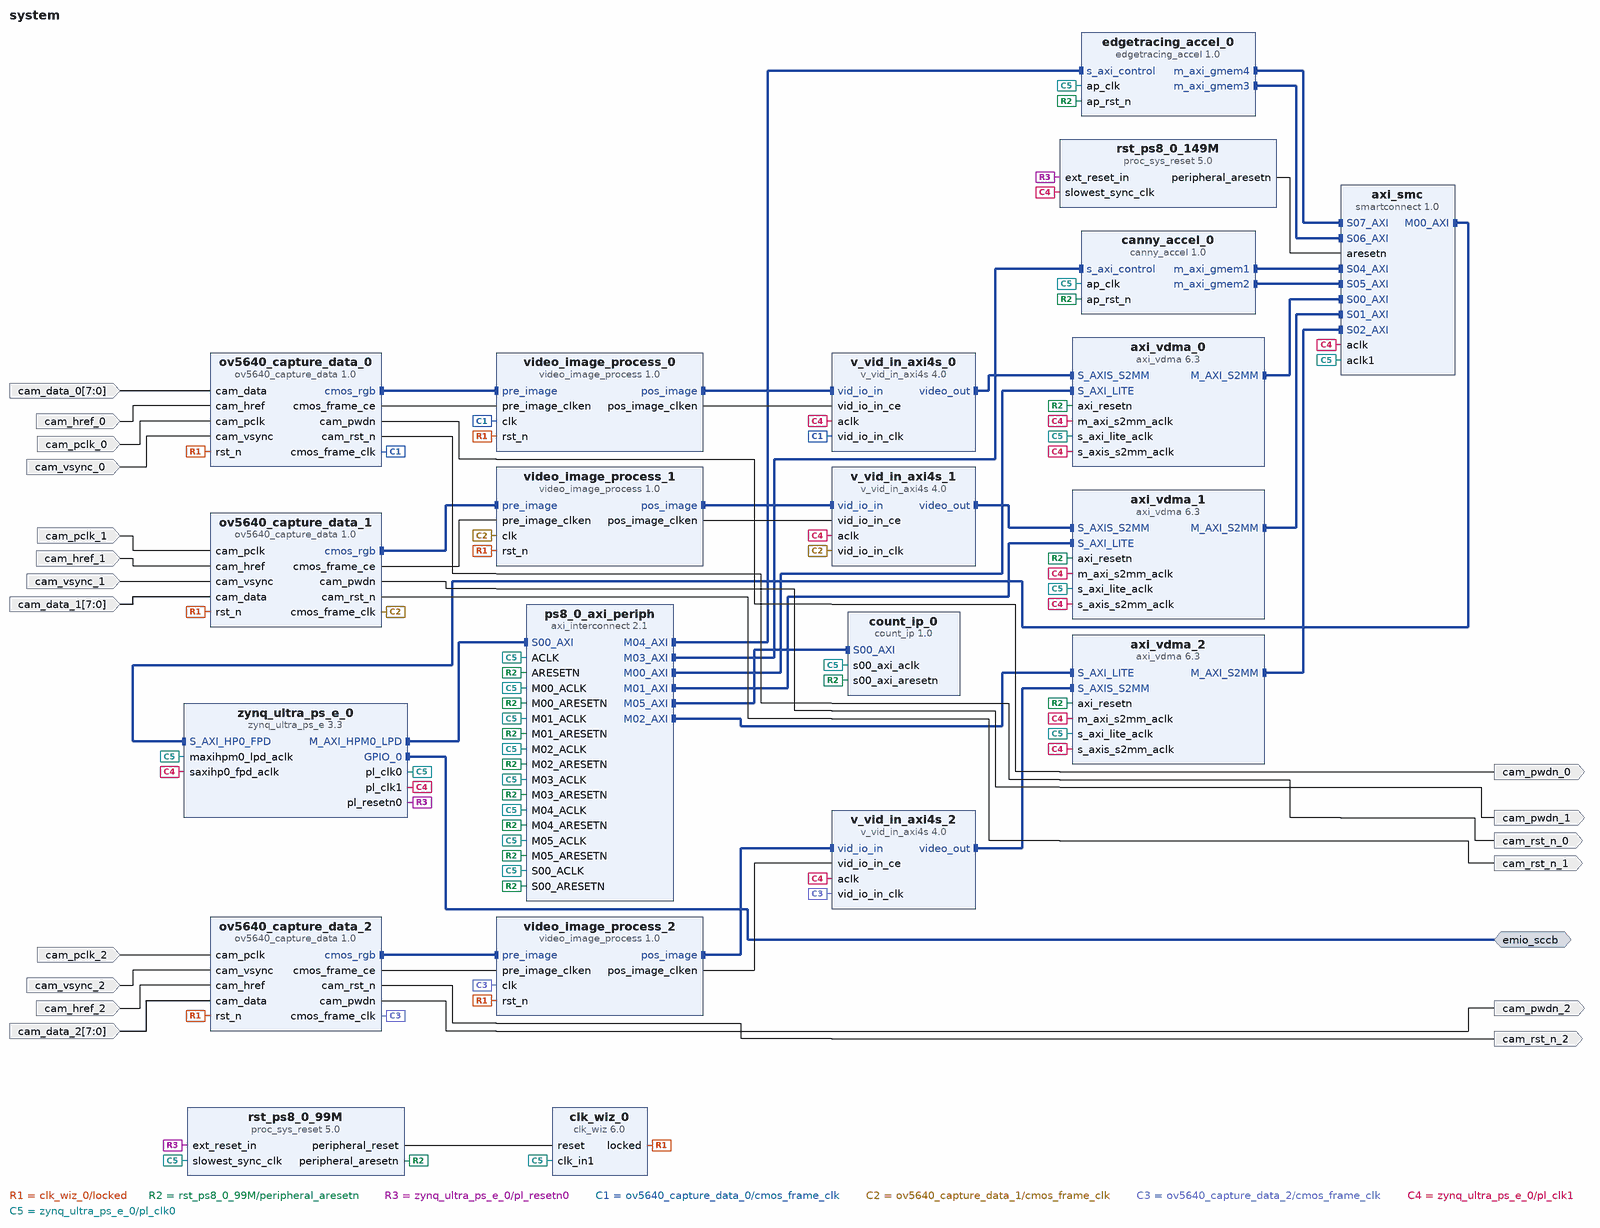
[diagram p0: block diagram of the top level]
# Vivado block design system, xczu2cg-sfvc784-2-i, Vivado 2020.2
create_bd_design system

create_bd_intf_port -mode Master -vlnv xilinx.com:interface:gpio_rtl:1.0 emio_sccb
create_bd_port -dir I -from 7 -to 0 cam_data_0
create_bd_port -dir I cam_href_0
create_bd_port -dir I cam_pclk_0
create_bd_port -dir O cam_pwdn_0
create_bd_port -dir O -type rst cam_rst_n_0
create_bd_port -dir I cam_vsync_0
create_bd_port -dir I cam_pclk_1
create_bd_port -dir I cam_href_1
create_bd_port -dir I cam_vsync_1
create_bd_port -dir I -from 7 -to 0 cam_data_1
create_bd_port -dir O cam_pwdn_1
create_bd_port -dir O -type rst cam_rst_n_1
create_bd_port -dir I cam_pclk_2
create_bd_port -dir I cam_vsync_2
create_bd_port -dir I cam_href_2
create_bd_port -dir I -from 7 -to 0 cam_data_2
create_bd_port -dir O -type rst cam_rst_n_2
create_bd_port -dir O cam_pwdn_2

create_bd_cell -type ip -vlnv xilinx.com:ip:axi_vdma:6.3 axi_vdma_0
set_property -dict [list \
  CONFIG.c_include_mm2s 0 \
  CONFIG.c_include_s2mm 1 \
  CONFIG.c_num_fstores 1 \
  CONFIG.c_s2mm_genlock_mode 0 \
  CONFIG.c_s2mm_linebuffer_depth 2048 \
  CONFIG.c_s2mm_max_burst_length 64 \
] [get_bd_cells axi_vdma_0]
create_bd_cell -type ip -vlnv xilinx.com:ip:clk_wiz:6.0 clk_wiz_0
set_property -dict [list \
  CONFIG.AXI_DRP false \
  CONFIG.CLKIN2_JITTER_PS 100.0 \
  CONFIG.CLKOUT1_DRIVES Buffer \
  CONFIG.CLKOUT1_JITTER 148.818 \
  CONFIG.CLKOUT1_PHASE_ERROR 251.185 \
  CONFIG.CLKOUT1_REQUESTED_OUT_FREQ 75 \
  CONFIG.CLKOUT2_DRIVES Buffer \
  CONFIG.CLKOUT2_JITTER 132.180 \
  CONFIG.CLKOUT2_PHASE_ERROR 251.185 \
  CONFIG.CLKOUT2_REQUESTED_OUT_FREQ 187.5 \
  CONFIG.CLKOUT2_USED true \
  CONFIG.CLKOUT3_DRIVES Buffer \
  CONFIG.CLKOUT3_JITTER 121.133 \
  CONFIG.CLKOUT3_PHASE_ERROR 251.185 \
  CONFIG.CLKOUT3_REQUESTED_OUT_FREQ 375 \
  CONFIG.CLKOUT3_USED true \
  CONFIG.CLKOUT4_DRIVES Buffer \
  CONFIG.CLKOUT5_DRIVES Buffer \
  CONFIG.CLKOUT6_DRIVES Buffer \
  CONFIG.CLKOUT7_DRIVES Buffer \
  CONFIG.MMCM_CLKFBOUT_MULT_F 75 \
  CONFIG.MMCM_CLKIN2_PERIOD 10.000 \
  CONFIG.MMCM_CLKOUT0_DIVIDE_F 20 \
  CONFIG.MMCM_CLKOUT1_DIVIDE 8 \
  CONFIG.MMCM_CLKOUT2_DIVIDE 4 \
  CONFIG.MMCM_DIVCLK_DIVIDE 5 \
  CONFIG.NUM_OUT_CLKS 3 \
  CONFIG.OVERRIDE_MMCM true \
  CONFIG.PHASE_DUTY_CONFIG false \
  CONFIG.SECONDARY_IN_FREQ 100.000 \
  CONFIG.SECONDARY_SOURCE Single_ended_clock_capable_pin \
  CONFIG.USE_DYN_RECONFIG false \
  CONFIG.USE_INCLK_SWITCHOVER false \
  CONFIG.USE_PHASE_ALIGNMENT false \
] [get_bd_cells clk_wiz_0]
create_bd_cell -type ip -vlnv xilinx.com:ip:proc_sys_reset:5.0 rst_ps8_0_99M
create_bd_cell -type ip -vlnv xilinx.com:ip:zynq_ultra_ps_e:3.3 zynq_ultra_ps_e_0
set_property -dict [list \
  CONFIG.CAN0_BOARD_INTERFACE custom \
  CONFIG.CAN1_BOARD_INTERFACE custom \
  CONFIG.CSU_BOARD_INTERFACE custom \
  CONFIG.DP_BOARD_INTERFACE custom \
  CONFIG.GEM0_BOARD_INTERFACE custom \
  CONFIG.GEM1_BOARD_INTERFACE custom \
  CONFIG.GEM2_BOARD_INTERFACE custom \
  CONFIG.GEM3_BOARD_INTERFACE custom \
  CONFIG.GPIO_BOARD_INTERFACE custom \
  CONFIG.IIC0_BOARD_INTERFACE custom \
  CONFIG.IIC1_BOARD_INTERFACE custom \
  CONFIG.NAND_BOARD_INTERFACE custom \
  CONFIG.PCIE_BOARD_INTERFACE custom \
  CONFIG.PJTAG_BOARD_INTERFACE custom \
  CONFIG.PMU_BOARD_INTERFACE custom \
  CONFIG.PSU_BANK_0_IO_STANDARD LVCMOS18 \
  CONFIG.PSU_BANK_1_IO_STANDARD LVCMOS33 \
  CONFIG.PSU_BANK_2_IO_STANDARD LVCMOS18 \
  CONFIG.PSU_BANK_3_IO_STANDARD LVCMOS33 \
  CONFIG.PSU_USB3__DUAL_CLOCK_ENABLE 0 \
  CONFIG.PSU__ACPU2__POWER__ON 0 \
  CONFIG.PSU__ACPU3__POWER__ON 0 \
  CONFIG.PSU__CAN1__PERIPHERAL__ENABLE 0 \
  CONFIG.PSU__CRF_APB__ACPU_CTRL__FREQMHZ 1333.333 \
  CONFIG.PSU__CRF_APB__ACPU_CTRL__SRCSEL APLL \
  CONFIG.PSU__CRF_APB__APLL_CTRL__SRCSEL PSS_REF_CLK \
  CONFIG.PSU__CRF_APB__DBG_FPD_CTRL__FREQMHZ 250 \
  CONFIG.PSU__CRF_APB__DBG_FPD_CTRL__SRCSEL IOPLL \
  CONFIG.PSU__CRF_APB__DBG_TRACE_CTRL__FREQMHZ 250 \
  CONFIG.PSU__CRF_APB__DBG_TRACE_CTRL__SRCSEL IOPLL \
  CONFIG.PSU__CRF_APB__DBG_TSTMP_CTRL__FREQMHZ 250 \
  CONFIG.PSU__CRF_APB__DBG_TSTMP_CTRL__SRCSEL IOPLL \
  CONFIG.PSU__CRF_APB__DDR_CTRL__FREQMHZ 1200 \
  CONFIG.PSU__CRF_APB__DDR_CTRL__SRCSEL DPLL \
  CONFIG.PSU__CRF_APB__DPDMA_REF_CTRL__FREQMHZ 600 \
  CONFIG.PSU__CRF_APB__DPDMA_REF_CTRL__SRCSEL DPLL \
  CONFIG.PSU__CRF_APB__DPLL_CTRL__SRCSEL PSS_REF_CLK \
  CONFIG.PSU__CRF_APB__DP_AUDIO_REF_CTRL__SRCSEL VPLL \
  CONFIG.PSU__CRF_APB__DP_STC_REF_CTRL__SRCSEL VPLL \
  CONFIG.PSU__CRF_APB__DP_VIDEO_REF_CTRL__SRCSEL DPLL \
  CONFIG.PSU__CRF_APB__GDMA_REF_CTRL__FREQMHZ 600 \
  CONFIG.PSU__CRF_APB__GDMA_REF_CTRL__SRCSEL DPLL \
  CONFIG.PSU__CRF_APB__GPU_REF_CTRL__FREQMHZ 600 \
  CONFIG.PSU__CRF_APB__GPU_REF_CTRL__SRCSEL DPLL \
  CONFIG.PSU__CRF_APB__TOPSW_LSBUS_CTRL__FREQMHZ 100 \
  CONFIG.PSU__CRF_APB__TOPSW_LSBUS_CTRL__SRCSEL IOPLL \
  CONFIG.PSU__CRF_APB__TOPSW_MAIN_CTRL__FREQMHZ 533.333 \
  CONFIG.PSU__CRF_APB__TOPSW_MAIN_CTRL__SRCSEL VPLL \
  CONFIG.PSU__CRF_APB__VPLL_CTRL__SRCSEL PSS_REF_CLK \
  CONFIG.PSU__CRL_APB__ADMA_REF_CTRL__FREQMHZ 533.333 \
  CONFIG.PSU__CRL_APB__ADMA_REF_CTRL__SRCSEL RPLL \
  CONFIG.PSU__CRL_APB__CAN1_REF_CTRL__FREQMHZ 100 \
  CONFIG.PSU__CRL_APB__CAN1_REF_CTRL__SRCSEL IOPLL \
  CONFIG.PSU__CRL_APB__CPU_R5_CTRL__FREQMHZ 533.333 \
  CONFIG.PSU__CRL_APB__CPU_R5_CTRL__SRCSEL RPLL \
  CONFIG.PSU__CRL_APB__DBG_LPD_CTRL__FREQMHZ 250 \
  CONFIG.PSU__CRL_APB__DBG_LPD_CTRL__SRCSEL IOPLL \
  CONFIG.PSU__CRL_APB__GEM3_REF_CTRL__FREQMHZ 125 \
  CONFIG.PSU__CRL_APB__GEM3_REF_CTRL__SRCSEL IOPLL \
  CONFIG.PSU__CRL_APB__I2C0_REF_CTRL__FREQMHZ 100 \
  CONFIG.PSU__CRL_APB__I2C0_REF_CTRL__SRCSEL IOPLL \
  CONFIG.PSU__CRL_APB__I2C1_REF_CTRL__FREQMHZ 100 \
  CONFIG.PSU__CRL_APB__I2C1_REF_CTRL__SRCSEL IOPLL \
  CONFIG.PSU__CRL_APB__IOPLL_CTRL__SRCSEL PSS_REF_CLK \
  CONFIG.PSU__CRL_APB__IOU_SWITCH_CTRL__FREQMHZ 267 \
  CONFIG.PSU__CRL_APB__IOU_SWITCH_CTRL__SRCSEL RPLL \
  CONFIG.PSU__CRL_APB__LPD_LSBUS_CTRL__FREQMHZ 100 \
  CONFIG.PSU__CRL_APB__LPD_LSBUS_CTRL__SRCSEL IOPLL \
  CONFIG.PSU__CRL_APB__LPD_SWITCH_CTRL__FREQMHZ 533.333 \
  CONFIG.PSU__CRL_APB__LPD_SWITCH_CTRL__SRCSEL RPLL \
  CONFIG.PSU__CRL_APB__PCAP_CTRL__FREQMHZ 200 \
  CONFIG.PSU__CRL_APB__PCAP_CTRL__SRCSEL IOPLL \
  CONFIG.PSU__CRL_APB__PL0_REF_CTRL__FREQMHZ 100 \
  CONFIG.PSU__CRL_APB__PL0_REF_CTRL__SRCSEL IOPLL \
  CONFIG.PSU__CRL_APB__PL1_REF_CTRL__FREQMHZ 150 \
  CONFIG.PSU__CRL_APB__QSPI_REF_CTRL__FREQMHZ 300 \
  CONFIG.PSU__CRL_APB__QSPI_REF_CTRL__SRCSEL IOPLL \
  CONFIG.PSU__CRL_APB__RPLL_CTRL__SRCSEL PSS_REF_CLK \
  CONFIG.PSU__CRL_APB__SDIO1_REF_CTRL__FREQMHZ 200 \
  CONFIG.PSU__CRL_APB__SDIO1_REF_CTRL__SRCSEL RPLL \
  CONFIG.PSU__CRL_APB__TIMESTAMP_REF_CTRL__FREQMHZ 100 \
  CONFIG.PSU__CRL_APB__TIMESTAMP_REF_CTRL__SRCSEL PSS_REF_CLK \
  CONFIG.PSU__CRL_APB__UART0_REF_CTRL__FREQMHZ 100 \
  CONFIG.PSU__CRL_APB__UART0_REF_CTRL__SRCSEL IOPLL \
  CONFIG.PSU__CRL_APB__UART1_REF_CTRL__FREQMHZ 100 \
  CONFIG.PSU__CRL_APB__UART1_REF_CTRL__SRCSEL IOPLL \
  CONFIG.PSU__CRL_APB__USB0_BUS_REF_CTRL__FREQMHZ 250 \
  CONFIG.PSU__CRL_APB__USB0_BUS_REF_CTRL__SRCSEL IOPLL \
  CONFIG.PSU__CRL_APB__USB3_DUAL_REF_CTRL__FREQMHZ 20 \
  CONFIG.PSU__CRL_APB__USB3_DUAL_REF_CTRL__SRCSEL IOPLL \
  CONFIG.PSU__CRL_APB__USB3__ENABLE 0 \
  CONFIG.PSU__CSUPMU__PERIPHERAL__VALID 0 \
  CONFIG.PSU__DDRC__BUS_WIDTH {64 Bit} \
  CONFIG.PSU__DDRC__COMPONENTS Components \
  CONFIG.PSU__DDRC__DEVICE_CAPACITY {4096 MBits} \
  CONFIG.PSU__DDRC__DRAM_WIDTH {16 Bits} \
  CONFIG.PSU__DDRC__ECC Disabled \
  CONFIG.PSU__DDRC__MEMORY_TYPE {DDR 4} \
  CONFIG.PSU__DDRC__SPEED_BIN DDR4_2400P \
  CONFIG.PSU__DDR_HIGH_ADDRESS_GUI_ENABLE 0 \
  CONFIG.PSU__DDR__INTERFACE__FREQMHZ 600.000 \
  CONFIG.PSU__DEVICE_TYPE CG \
  CONFIG.PSU__DISPLAYPORT__PERIPHERAL__ENABLE 0 \
  CONFIG.PSU__DLL__ISUSED 1 \
  CONFIG.PSU__ENET3__PERIPHERAL__ENABLE 0 \
  CONFIG.PSU__FPD_SLCR__WDT1__FREQMHZ 100 \
  CONFIG.PSU__FPGA_PL0_ENABLE 1 \
  CONFIG.PSU__FPGA_PL1_ENABLE 1 \
  CONFIG.PSU__GPIO0_MIO__IO {MIO 0 .. 25} \
  CONFIG.PSU__GPIO0_MIO__PERIPHERAL__ENABLE 1 \
  CONFIG.PSU__GPIO1_MIO__IO {MIO 26 .. 51} \
  CONFIG.PSU__GPIO1_MIO__PERIPHERAL__ENABLE 1 \
  CONFIG.PSU__GPIO_EMIO_WIDTH 6 \
  CONFIG.PSU__GPIO_EMIO__PERIPHERAL__ENABLE 1 \
  CONFIG.PSU__GPIO_EMIO__PERIPHERAL__IO 6 \
  CONFIG.PSU__GPU_PP0__POWER__ON 0 \
  CONFIG.PSU__GPU_PP1__POWER__ON 0 \
  CONFIG.PSU__I2C0__PERIPHERAL__ENABLE 0 \
  CONFIG.PSU__I2C1__PERIPHERAL__ENABLE 0 \
  CONFIG.PSU__IOU_SLCR__IOU_TTC_APB_CLK__TTC0_SEL APB \
  CONFIG.PSU__IOU_SLCR__IOU_TTC_APB_CLK__TTC1_SEL APB \
  CONFIG.PSU__IOU_SLCR__IOU_TTC_APB_CLK__TTC2_SEL APB \
  CONFIG.PSU__IOU_SLCR__IOU_TTC_APB_CLK__TTC3_SEL APB \
  CONFIG.PSU__IOU_SLCR__TTC0__FREQMHZ 100 \
  CONFIG.PSU__IOU_SLCR__TTC1__FREQMHZ 100 \
  CONFIG.PSU__IOU_SLCR__TTC2__FREQMHZ 100 \
  CONFIG.PSU__IOU_SLCR__TTC3__FREQMHZ 100 \
  CONFIG.PSU__IOU_SLCR__WDT0__FREQMHZ 100 \
  CONFIG.PSU__LPD_SLCR__CSUPMU__FREQMHZ 100 \
  CONFIG.PSU__OVERRIDE_HPX_QOS 0 \
  CONFIG.PSU__OVERRIDE__BASIC_CLOCK 0 \
  CONFIG.PSU__PMU__PERIPHERAL__ENABLE 0 \
  CONFIG.PSU__PRESET_APPLIED 0 \
  CONFIG.PSU__PSS_REF_CLK__FREQMHZ 33.333 \
  CONFIG.PSU__QSPI_COHERENCY 0 \
  CONFIG.PSU__QSPI_ROUTE_THROUGH_FPD 0 \
  CONFIG.PSU__QSPI__GRP_FBCLK__ENABLE 1 \
  CONFIG.PSU__QSPI__GRP_FBCLK__IO {MIO 6} \
  CONFIG.PSU__QSPI__PERIPHERAL__DATA_MODE x4 \
  CONFIG.PSU__QSPI__PERIPHERAL__ENABLE 1 \
  CONFIG.PSU__QSPI__PERIPHERAL__IO {MIO 0 .. 5} \
  CONFIG.PSU__QSPI__PERIPHERAL__MODE Single \
  CONFIG.PSU__SATA__PERIPHERAL__ENABLE 0 \
  CONFIG.PSU__SD1_COHERENCY 0 \
  CONFIG.PSU__SD1_ROUTE_THROUGH_FPD 0 \
  CONFIG.PSU__SD1__DATA_TRANSFER_MODE 4Bit \
  CONFIG.PSU__SD1__GRP_CD__ENABLE 1 \
  CONFIG.PSU__SD1__GRP_CD__IO {MIO 45} \
  CONFIG.PSU__SD1__GRP_POW__ENABLE 0 \
  CONFIG.PSU__SD1__GRP_WP__ENABLE 0 \
  CONFIG.PSU__SD1__PERIPHERAL__ENABLE 1 \
  CONFIG.PSU__SD1__PERIPHERAL__IO {MIO 46 .. 51} \
  CONFIG.PSU__SD1__SLOT_TYPE {SD 2.0} \
  CONFIG.PSU__SWDT0__PERIPHERAL__ENABLE 0 \
  CONFIG.PSU__SWDT1__PERIPHERAL__ENABLE 0 \
  CONFIG.PSU__TTC0__PERIPHERAL__ENABLE 0 \
  CONFIG.PSU__TTC1__PERIPHERAL__ENABLE 0 \
  CONFIG.PSU__TTC2__PERIPHERAL__ENABLE 0 \
  CONFIG.PSU__TTC3__PERIPHERAL__ENABLE 0 \
  CONFIG.PSU__UART0__BAUD_RATE 115200 \
  CONFIG.PSU__UART0__MODEM__ENABLE 0 \
  CONFIG.PSU__UART0__PERIPHERAL__ENABLE 1 \
  CONFIG.PSU__UART0__PERIPHERAL__IO {MIO 42 .. 43} \
  CONFIG.PSU__UART1__PERIPHERAL__ENABLE 0 \
  CONFIG.PSU__USB0__PERIPHERAL__ENABLE 0 \
  CONFIG.PSU__USE__IRQ0 0 \
  CONFIG.PSU__USE__M_AXI_GP0 0 \
  CONFIG.PSU__USE__M_AXI_GP1 0 \
  CONFIG.PSU__USE__M_AXI_GP2 1 \
  CONFIG.PSU__USE__S_AXI_GP2 1 \
  CONFIG.QSPI_BOARD_INTERFACE custom \
  CONFIG.SATA_BOARD_INTERFACE custom \
  CONFIG.SD0_BOARD_INTERFACE custom \
  CONFIG.SD1_BOARD_INTERFACE custom \
  CONFIG.SPI0_BOARD_INTERFACE custom \
  CONFIG.SPI1_BOARD_INTERFACE custom \
  CONFIG.SUBPRESET1 Custom \
  CONFIG.SUBPRESET2 Custom \
  CONFIG.SWDT0_BOARD_INTERFACE custom \
  CONFIG.SWDT1_BOARD_INTERFACE custom \
  CONFIG.TRACE_BOARD_INTERFACE custom \
  CONFIG.TTC0_BOARD_INTERFACE custom \
  CONFIG.TTC1_BOARD_INTERFACE custom \
  CONFIG.TTC2_BOARD_INTERFACE custom \
  CONFIG.TTC3_BOARD_INTERFACE custom \
  CONFIG.UART0_BOARD_INTERFACE custom \
  CONFIG.UART1_BOARD_INTERFACE custom \
  CONFIG.USB0_BOARD_INTERFACE custom \
  CONFIG.USB1_BOARD_INTERFACE custom \
] [get_bd_cells zynq_ultra_ps_e_0]
# 774 more settings of zynq_ultra_ps_e_0 are not shown: defaults, MIO pin electricals, DDR timing, and values the tool derives
create_bd_cell -type ip -vlnv xilinx.com:ip:v_vid_in_axi4s:4.0 v_vid_in_axi4s_0
set_property -dict {CONFIG.C_HAS_ASYNC_CLK 1} [get_bd_cells v_vid_in_axi4s_0]
create_bd_cell -type ip -vlnv xilinx.com:ip:v_vid_in_axi4s:4.0 v_vid_in_axi4s_1
set_property -dict {CONFIG.C_HAS_ASYNC_CLK 1} [get_bd_cells v_vid_in_axi4s_1]
create_bd_cell -type ip -vlnv xilinx.com:ip:axi_vdma:6.3 axi_vdma_1
set_property -dict [list \
  CONFIG.c_include_mm2s 0 \
  CONFIG.c_include_s2mm 1 \
  CONFIG.c_num_fstores 1 \
  CONFIG.c_s2mm_genlock_mode 1 \
  CONFIG.c_s2mm_linebuffer_depth 2048 \
  CONFIG.c_s2mm_max_burst_length 64 \
] [get_bd_cells axi_vdma_1]
create_bd_cell -type ip -vlnv xilinx.com:ip:v_vid_in_axi4s:4.0 v_vid_in_axi4s_2
set_property -dict {CONFIG.C_HAS_ASYNC_CLK 1} [get_bd_cells v_vid_in_axi4s_2]
create_bd_cell -type ip -vlnv xilinx.com:ip:axi_vdma:6.3 axi_vdma_2
set_property -dict [list \
  CONFIG.c_include_mm2s 0 \
  CONFIG.c_include_s2mm 1 \
  CONFIG.c_num_fstores 1 \
  CONFIG.c_s2mm_genlock_mode 1 \
  CONFIG.c_s2mm_linebuffer_depth 2048 \
  CONFIG.c_s2mm_max_burst_length 64 \
] [get_bd_cells axi_vdma_2]
create_bd_cell -type ip -vlnv xilinx.com:ip:proc_sys_reset:5.0 rst_ps8_0_149M
create_bd_cell -type ip -vlnv xilinx.com:ip:smartconnect:1.0 axi_smc
set_property -dict {CONFIG.NUM_CLKS 2 CONFIG.NUM_SI 8} [get_bd_cells axi_smc]
create_bd_cell -type ip -vlnv xilinx.com:ip:axi_interconnect:2.1 ps8_0_axi_periph
set_property -dict {CONFIG.NUM_MI 6} [get_bd_cells ps8_0_axi_periph]
create_bd_cell -type ip -vlnv xilinx.com:hls:canny_accel:1.0 canny_accel_0
create_bd_cell -type ip -vlnv xilinx.com:hls:edgetracing_accel:1.0 edgetracing_accel_0
create_bd_cell -type ip -vlnv alientek.com:user:ov5640_capture_data:1.0 ov5640_capture_data_0
create_bd_cell -type ip -vlnv alientek.com:user:ov5640_capture_data:1.0 ov5640_capture_data_1
create_bd_cell -type ip -vlnv alientek.com:user:ov5640_capture_data:1.0 ov5640_capture_data_2
create_bd_cell -type ip -vlnv xilinx.com:user:video_image_process:1.0 video_image_process_0
create_bd_cell -type ip -vlnv xilinx.com:user:video_image_process:1.0 video_image_process_1
create_bd_cell -type ip -vlnv xilinx.com:user:video_image_process:1.0 video_image_process_2
create_bd_cell -type ip -vlnv xilinx.com:user:count_ip:1.0 count_ip_0

# ---- connections ----

connect_bd_intf_net [get_bd_intf_pins ps8_0_axi_periph/M04_AXI] [get_bd_intf_pins edgetracing_accel_0/s_axi_control]
connect_bd_intf_net [get_bd_intf_pins v_vid_in_axi4s_1/video_out] [get_bd_intf_pins axi_vdma_1/S_AXIS_S2MM]
connect_bd_intf_net [get_bd_intf_pins zynq_ultra_ps_e_0/M_AXI_HPM0_LPD] [get_bd_intf_pins ps8_0_axi_periph/S00_AXI]
connect_bd_intf_net [get_bd_intf_pins ov5640_capture_data_0/cmos_rgb] [get_bd_intf_pins video_image_process_0/pre_image]
connect_bd_intf_net [get_bd_intf_pins edgetracing_accel_0/m_axi_gmem4] [get_bd_intf_pins axi_smc/S07_AXI]
connect_bd_intf_net [get_bd_intf_pins axi_vdma_0/M_AXI_S2MM] [get_bd_intf_pins axi_smc/S00_AXI]
connect_bd_intf_net [get_bd_intf_pins canny_accel_0/m_axi_gmem1] [get_bd_intf_pins axi_smc/S04_AXI]
connect_bd_intf_net [get_bd_intf_pins video_image_process_0/pos_image] [get_bd_intf_pins v_vid_in_axi4s_0/vid_io_in]
connect_bd_intf_net [get_bd_intf_pins video_image_process_2/pos_image] [get_bd_intf_pins v_vid_in_axi4s_2/vid_io_in]
connect_bd_intf_net [get_bd_intf_pins v_vid_in_axi4s_0/video_out] [get_bd_intf_pins axi_vdma_0/S_AXIS_S2MM]
connect_bd_intf_net [get_bd_intf_pins axi_vdma_1/M_AXI_S2MM] [get_bd_intf_pins axi_smc/S01_AXI]
connect_bd_intf_net [get_bd_intf_pins ps8_0_axi_periph/M03_AXI] [get_bd_intf_pins canny_accel_0/s_axi_control]
connect_bd_intf_net [get_bd_intf_pins ps8_0_axi_periph/M00_AXI] [get_bd_intf_pins axi_vdma_0/S_AXI_LITE]
connect_bd_intf_net [get_bd_intf_pins ps8_0_axi_periph/M01_AXI] [get_bd_intf_pins axi_vdma_1/S_AXI_LITE]
connect_bd_intf_net [get_bd_intf_pins axi_vdma_2/M_AXI_S2MM] [get_bd_intf_pins axi_smc/S02_AXI]
connect_bd_intf_net [get_bd_intf_pins edgetracing_accel_0/m_axi_gmem3] [get_bd_intf_pins axi_smc/S06_AXI]
connect_bd_intf_net [get_bd_intf_pins video_image_process_1/pos_image] [get_bd_intf_pins v_vid_in_axi4s_1/vid_io_in]
connect_bd_intf_net [get_bd_intf_pins v_vid_in_axi4s_2/video_out] [get_bd_intf_pins axi_vdma_2/S_AXIS_S2MM]
connect_bd_intf_net [get_bd_intf_pins ov5640_capture_data_2/cmos_rgb] [get_bd_intf_pins video_image_process_2/pre_image]
connect_bd_intf_net [get_bd_intf_pins axi_smc/M00_AXI] [get_bd_intf_pins zynq_ultra_ps_e_0/S_AXI_HP0_FPD]
connect_bd_intf_net [get_bd_intf_pins canny_accel_0/m_axi_gmem2] [get_bd_intf_pins axi_smc/S05_AXI]
connect_bd_intf_net [get_bd_intf_ports emio_sccb] [get_bd_intf_pins zynq_ultra_ps_e_0/GPIO_0]
connect_bd_intf_net [get_bd_intf_pins ps8_0_axi_periph/M02_AXI] [get_bd_intf_pins axi_vdma_2/S_AXI_LITE]
connect_bd_intf_net [get_bd_intf_pins ov5640_capture_data_1/cmos_rgb] [get_bd_intf_pins video_image_process_1/pre_image]
connect_bd_intf_net [get_bd_intf_pins ps8_0_axi_periph/M05_AXI] [get_bd_intf_pins count_ip_0/S00_AXI]
connect_bd_net -net cam_data_0_1 [get_bd_ports cam_data_0] [get_bd_pins ov5640_capture_data_0/cam_data]
connect_bd_net -net cam_href_0_1 [get_bd_ports cam_href_0] [get_bd_pins ov5640_capture_data_0/cam_href]
connect_bd_net -net cam_pclk_0_1 [get_bd_ports cam_pclk_0] [get_bd_pins ov5640_capture_data_0/cam_pclk]
connect_bd_net -net cam_vsync_0_1 [get_bd_ports cam_vsync_0] [get_bd_pins ov5640_capture_data_0/cam_vsync]
connect_bd_net [get_bd_pins clk_wiz_0/locked] \
  [get_bd_pins ov5640_capture_data_0/rst_n] [get_bd_pins ov5640_capture_data_1/rst_n] \
  [get_bd_pins ov5640_capture_data_2/rst_n] [get_bd_pins video_image_process_0/rst_n] \
  [get_bd_pins video_image_process_1/rst_n] [get_bd_pins video_image_process_2/rst_n]
connect_bd_net [get_bd_pins ov5640_capture_data_0/cam_pwdn] [get_bd_ports cam_pwdn_0]
connect_bd_net [get_bd_pins ov5640_capture_data_0/cam_rst_n] [get_bd_ports cam_rst_n_0]
connect_bd_net [get_bd_pins rst_ps8_0_99M/peripheral_aresetn] \
  [get_bd_pins axi_vdma_0/axi_resetn] [get_bd_pins axi_vdma_1/axi_resetn] [get_bd_pins axi_vdma_2/axi_resetn] \
  [get_bd_pins ps8_0_axi_periph/S00_ARESETN] [get_bd_pins ps8_0_axi_periph/M00_ARESETN] \
  [get_bd_pins ps8_0_axi_periph/ARESETN] [get_bd_pins ps8_0_axi_periph/M01_ARESETN] \
  [get_bd_pins ps8_0_axi_periph/M02_ARESETN] [get_bd_pins ps8_0_axi_periph/M03_ARESETN] \
  [get_bd_pins ps8_0_axi_periph/M04_ARESETN] [get_bd_pins canny_accel_0/ap_rst_n] [get_bd_pins edgetracing_accel_0/ap_rst_n] \
  [get_bd_pins ps8_0_axi_periph/M05_ARESETN] [get_bd_pins count_ip_0/s00_axi_aresetn]
connect_bd_net [get_bd_pins zynq_ultra_ps_e_0/pl_resetn0] [get_bd_pins rst_ps8_0_99M/ext_reset_in] [get_bd_pins rst_ps8_0_149M/ext_reset_in]
connect_bd_net [get_bd_pins ov5640_capture_data_0/cmos_frame_clk] [get_bd_pins v_vid_in_axi4s_0/vid_io_in_clk] [get_bd_pins video_image_process_0/clk]
connect_bd_net [get_bd_pins ov5640_capture_data_1/cmos_frame_clk] [get_bd_pins v_vid_in_axi4s_1/vid_io_in_clk] [get_bd_pins video_image_process_1/clk]
connect_bd_net -net cam_pclk_1_1 [get_bd_ports cam_pclk_1] [get_bd_pins ov5640_capture_data_1/cam_pclk]
connect_bd_net -net cam_href_1_1 [get_bd_ports cam_href_1] [get_bd_pins ov5640_capture_data_1/cam_href]
connect_bd_net -net cam_vsync_1_1 [get_bd_ports cam_vsync_1] [get_bd_pins ov5640_capture_data_1/cam_vsync]
connect_bd_net -net cam_data_1_1 [get_bd_ports cam_data_1] [get_bd_pins ov5640_capture_data_1/cam_data]
connect_bd_net [get_bd_pins ov5640_capture_data_1/cam_pwdn] [get_bd_ports cam_pwdn_1]
connect_bd_net [get_bd_pins ov5640_capture_data_1/cam_rst_n] [get_bd_ports cam_rst_n_1]
connect_bd_net [get_bd_pins ov5640_capture_data_0/cmos_frame_ce] [get_bd_pins video_image_process_0/pre_image_clken]
connect_bd_net [get_bd_pins video_image_process_0/pos_image_clken] [get_bd_pins v_vid_in_axi4s_0/vid_io_in_ce]
connect_bd_net [get_bd_pins ov5640_capture_data_1/cmos_frame_ce] [get_bd_pins video_image_process_1/pre_image_clken]
connect_bd_net [get_bd_pins video_image_process_1/pos_image_clken] [get_bd_pins v_vid_in_axi4s_1/vid_io_in_ce]
connect_bd_net [get_bd_pins rst_ps8_0_99M/peripheral_reset] [get_bd_pins clk_wiz_0/reset]
connect_bd_net [get_bd_pins video_image_process_2/pos_image_clken] [get_bd_pins v_vid_in_axi4s_2/vid_io_in_ce]
connect_bd_net [get_bd_pins ov5640_capture_data_2/cmos_frame_ce] [get_bd_pins video_image_process_2/pre_image_clken]
connect_bd_net [get_bd_pins ov5640_capture_data_2/cmos_frame_clk] [get_bd_pins v_vid_in_axi4s_2/vid_io_in_clk] [get_bd_pins video_image_process_2/clk]
connect_bd_net -net cam_pclk_2_1 [get_bd_ports cam_pclk_2] [get_bd_pins ov5640_capture_data_2/cam_pclk]
connect_bd_net -net cam_vsync_2_1 [get_bd_ports cam_vsync_2] [get_bd_pins ov5640_capture_data_2/cam_vsync]
connect_bd_net -net cam_href_2_1 [get_bd_ports cam_href_2] [get_bd_pins ov5640_capture_data_2/cam_href]
connect_bd_net -net cam_data_2_1 [get_bd_ports cam_data_2] [get_bd_pins ov5640_capture_data_2/cam_data]
connect_bd_net [get_bd_pins ov5640_capture_data_2/cam_rst_n] [get_bd_ports cam_rst_n_2]
connect_bd_net [get_bd_pins ov5640_capture_data_2/cam_pwdn] [get_bd_ports cam_pwdn_2]
connect_bd_net [get_bd_pins zynq_ultra_ps_e_0/pl_clk1] \
  [get_bd_pins axi_vdma_0/m_axi_s2mm_aclk] [get_bd_pins axi_vdma_0/s_axis_s2mm_aclk] [get_bd_pins v_vid_in_axi4s_0/aclk] \
  [get_bd_pins v_vid_in_axi4s_1/aclk] [get_bd_pins axi_vdma_1/s_axis_s2mm_aclk] [get_bd_pins axi_vdma_1/m_axi_s2mm_aclk] \
  [get_bd_pins zynq_ultra_ps_e_0/saxihp0_fpd_aclk] [get_bd_pins v_vid_in_axi4s_2/aclk] \
  [get_bd_pins axi_vdma_2/m_axi_s2mm_aclk] [get_bd_pins axi_vdma_2/s_axis_s2mm_aclk] \
  [get_bd_pins rst_ps8_0_149M/slowest_sync_clk] [get_bd_pins axi_smc/aclk]
connect_bd_net [get_bd_pins zynq_ultra_ps_e_0/pl_clk0] \
  [get_bd_pins zynq_ultra_ps_e_0/maxihpm0_lpd_aclk] [get_bd_pins axi_vdma_0/s_axi_lite_aclk] \
  [get_bd_pins rst_ps8_0_99M/slowest_sync_clk] [get_bd_pins axi_vdma_1/s_axi_lite_aclk] \
  [get_bd_pins axi_vdma_2/s_axi_lite_aclk] [get_bd_pins clk_wiz_0/clk_in1] [get_bd_pins axi_smc/aclk1] \
  [get_bd_pins ps8_0_axi_periph/ACLK] [get_bd_pins ps8_0_axi_periph/S00_ACLK] [get_bd_pins ps8_0_axi_periph/M00_ACLK] \
  [get_bd_pins ps8_0_axi_periph/M01_ACLK] [get_bd_pins ps8_0_axi_periph/M02_ACLK] [get_bd_pins ps8_0_axi_periph/M03_ACLK] \
  [get_bd_pins ps8_0_axi_periph/M04_ACLK] [get_bd_pins canny_accel_0/ap_clk] [get_bd_pins edgetracing_accel_0/ap_clk] \
  [get_bd_pins ps8_0_axi_periph/M05_ACLK] [get_bd_pins count_ip_0/s00_axi_aclk]
connect_bd_net [get_bd_pins rst_ps8_0_149M/peripheral_aresetn] [get_bd_pins axi_smc/aresetn]

# ---- address map ----
assign_bd_address -offset 0x00000000 -range 2G -target_address_space [get_bd_addr_spaces axi_vdma_0/Data_S2MM] [get_bd_addr_segs zynq_ultra_ps_e_0/SAXIGP2/HP0_DDR_LOW]
assign_bd_address -offset 0xC0000000 -range 512M -target_address_space [get_bd_addr_spaces axi_vdma_0/Data_S2MM] [get_bd_addr_segs zynq_ultra_ps_e_0/SAXIGP2/HP0_QSPI]
exclude_bd_addr_seg -offset 0xFF000000 -range 16M -target_address_space [get_bd_addr_spaces axi_vdma_0/Data_S2MM] [get_bd_addr_segs zynq_ultra_ps_e_0/SAXIGP2/HP0_LPS_OCM]
assign_bd_address -offset 0x00000000 -range 2G -target_address_space [get_bd_addr_spaces axi_vdma_1/Data_S2MM] [get_bd_addr_segs zynq_ultra_ps_e_0/SAXIGP2/HP0_DDR_LOW]
assign_bd_address -offset 0xC0000000 -range 512M -target_address_space [get_bd_addr_spaces axi_vdma_1/Data_S2MM] [get_bd_addr_segs zynq_ultra_ps_e_0/SAXIGP2/HP0_QSPI]
exclude_bd_addr_seg -offset 0xFF000000 -range 16M -target_address_space [get_bd_addr_spaces axi_vdma_1/Data_S2MM] [get_bd_addr_segs zynq_ultra_ps_e_0/SAXIGP2/HP0_LPS_OCM]
assign_bd_address -offset 0x00000000 -range 2G -target_address_space [get_bd_addr_spaces axi_vdma_2/Data_S2MM] [get_bd_addr_segs zynq_ultra_ps_e_0/SAXIGP2/HP0_DDR_LOW]
assign_bd_address -offset 0xC0000000 -range 512M -target_address_space [get_bd_addr_spaces axi_vdma_2/Data_S2MM] [get_bd_addr_segs zynq_ultra_ps_e_0/SAXIGP2/HP0_QSPI]
exclude_bd_addr_seg -offset 0xFF000000 -range 16M -target_address_space [get_bd_addr_spaces axi_vdma_2/Data_S2MM] [get_bd_addr_segs zynq_ultra_ps_e_0/SAXIGP2/HP0_LPS_OCM]
assign_bd_address -offset 0x0000000000000000 -range 2G -target_address_space [get_bd_addr_spaces canny_accel_0/Data_m_axi_gmem1] [get_bd_addr_segs zynq_ultra_ps_e_0/SAXIGP2/HP0_DDR_LOW]
assign_bd_address -offset 0x00000000C0000000 -range 512M -target_address_space [get_bd_addr_spaces canny_accel_0/Data_m_axi_gmem1] [get_bd_addr_segs zynq_ultra_ps_e_0/SAXIGP2/HP0_QSPI]
assign_bd_address -offset 0x0000000000000000 -range 2G -target_address_space [get_bd_addr_spaces canny_accel_0/Data_m_axi_gmem2] [get_bd_addr_segs zynq_ultra_ps_e_0/SAXIGP2/HP0_DDR_LOW]
assign_bd_address -offset 0x00000000C0000000 -range 512M -target_address_space [get_bd_addr_spaces canny_accel_0/Data_m_axi_gmem2] [get_bd_addr_segs zynq_ultra_ps_e_0/SAXIGP2/HP0_QSPI]
assign_bd_address -offset 0x0000000000000000 -range 2G -target_address_space [get_bd_addr_spaces edgetracing_accel_0/Data_m_axi_gmem3] [get_bd_addr_segs zynq_ultra_ps_e_0/SAXIGP2/HP0_DDR_LOW]
assign_bd_address -offset 0x00000000C0000000 -range 512M -target_address_space [get_bd_addr_spaces edgetracing_accel_0/Data_m_axi_gmem3] [get_bd_addr_segs zynq_ultra_ps_e_0/SAXIGP2/HP0_QSPI]
assign_bd_address -offset 0x0000000000000000 -range 2G -target_address_space [get_bd_addr_spaces edgetracing_accel_0/Data_m_axi_gmem4] [get_bd_addr_segs zynq_ultra_ps_e_0/SAXIGP2/HP0_DDR_LOW]
assign_bd_address -offset 0x00000000C0000000 -range 512M -target_address_space [get_bd_addr_spaces edgetracing_accel_0/Data_m_axi_gmem4] [get_bd_addr_segs zynq_ultra_ps_e_0/SAXIGP2/HP0_QSPI]
assign_bd_address -offset 0x0080000000 -range 64K -target_address_space [get_bd_addr_spaces zynq_ultra_ps_e_0/Data] [get_bd_addr_segs axi_vdma_1/S_AXI_LITE/Reg]
assign_bd_address -offset 0x0080010000 -range 64K -target_address_space [get_bd_addr_spaces zynq_ultra_ps_e_0/Data] [get_bd_addr_segs axi_vdma_0/S_AXI_LITE/Reg]
assign_bd_address -offset 0x0080020000 -range 64K -target_address_space [get_bd_addr_spaces zynq_ultra_ps_e_0/Data] [get_bd_addr_segs axi_vdma_2/S_AXI_LITE/Reg]
assign_bd_address -offset 0x0080030000 -range 64K -target_address_space [get_bd_addr_spaces zynq_ultra_ps_e_0/Data] [get_bd_addr_segs count_ip_0/S00_AXI/S00_AXI_reg]
assign_bd_address -offset 0x0080050000 -range 64K -target_address_space [get_bd_addr_spaces zynq_ultra_ps_e_0/Data] [get_bd_addr_segs canny_accel_0/s_axi_control/Reg]
assign_bd_address -offset 0x0080060000 -range 64K -target_address_space [get_bd_addr_spaces zynq_ultra_ps_e_0/Data] [get_bd_addr_segs edgetracing_accel_0/s_axi_control/Reg]

validate_bd_design
save_bd_design
